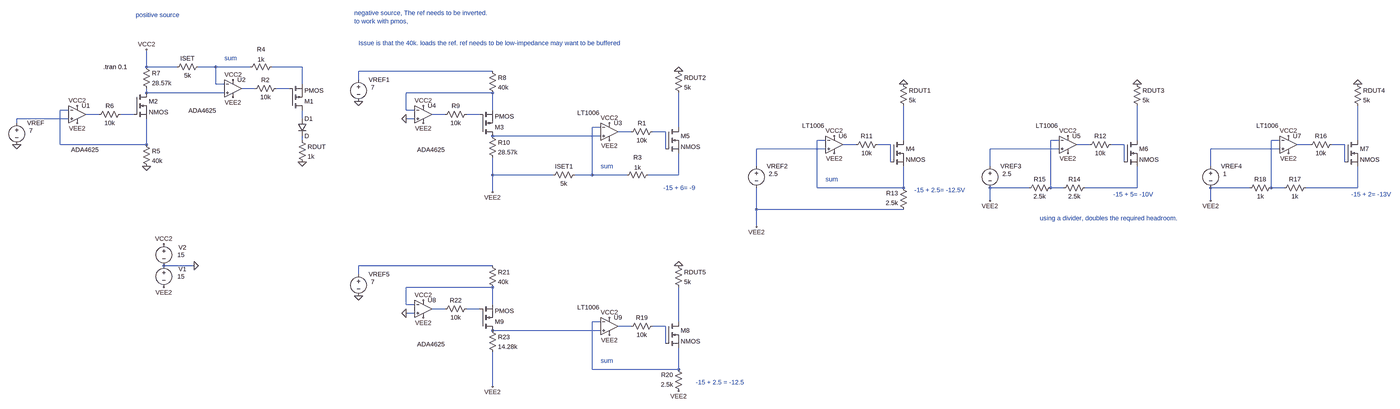
[diagram p0: schematic Draft25.asc, whole sheet]
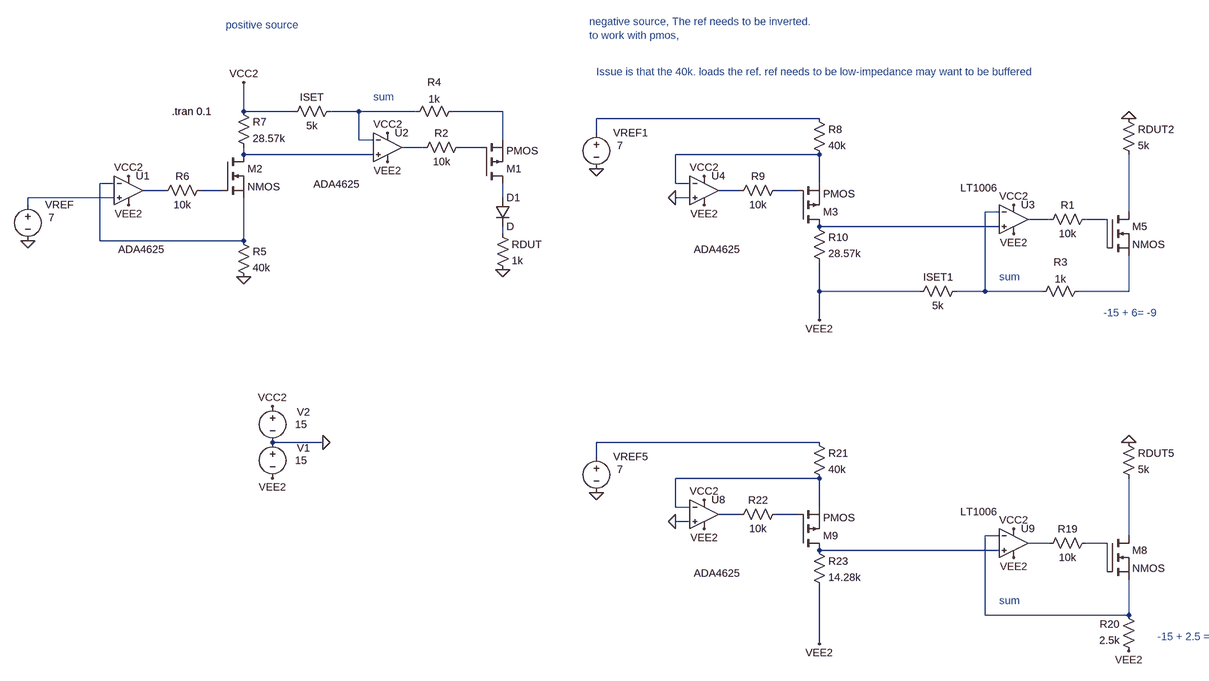
[diagram p1: schematic Draft25.asc, part, row 1 of 1, column 1 of 2]
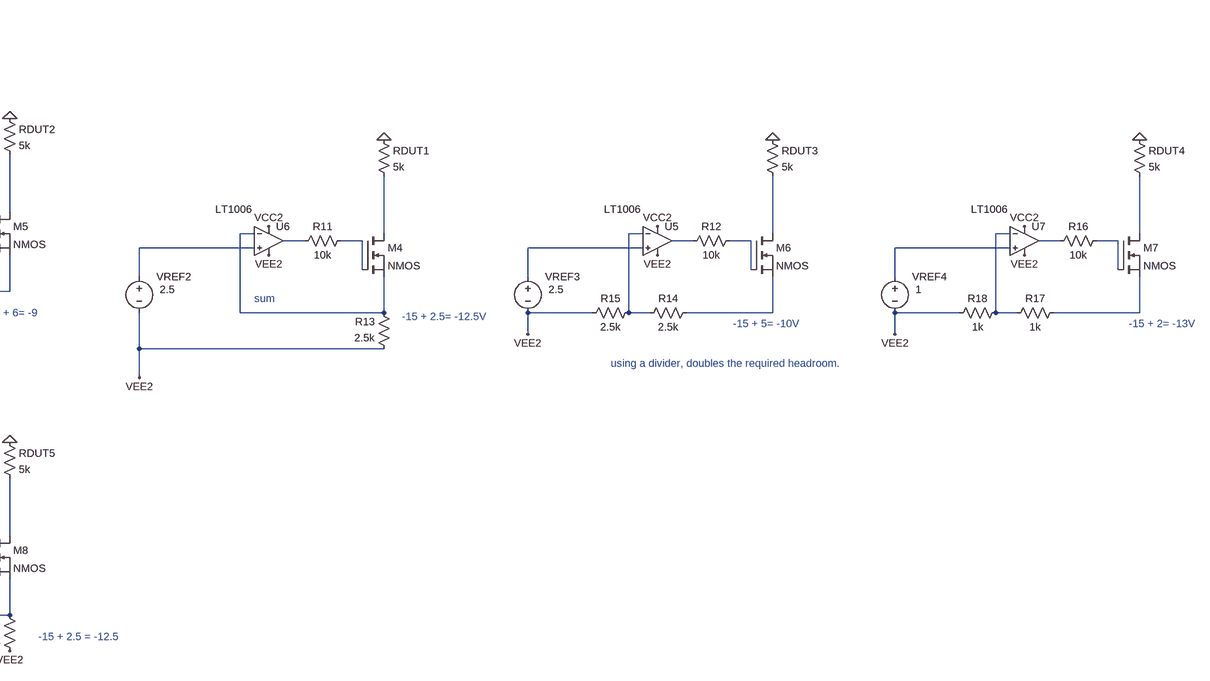
[diagram p2: schematic Draft25.asc, part, row 1 of 1, column 2 of 2]
Draft25.asc, the LTspice schematic file:
Version 4
SHEET 1 4612 1320
WIRE -64 16 -64 -48
WIRE 48 16 -64 16
WIRE 192 16 128 16
WIRE 320 16 192 16
WIRE 512 16 400 16
WIRE 1216 32 720 32
WIRE 720 64 720 32
WIRE 192 80 192 16
WIRE 224 80 192 80
WIRE 512 80 512 16
WIRE 336 96 288 96
WIRE 464 96 416 96
WIRE -64 112 -64 96
WIRE 224 112 -64 112
WIRE 1216 112 896 112
WIRE -64 128 -64 112
WIRE -352 176 -384 176
WIRE 896 176 896 112
WIRE 928 176 896 176
WIRE 1216 176 1216 112
WIRE -240 192 -288 192
WIRE -112 192 -160 192
WIRE 1040 192 992 192
WIRE 1168 192 1120 192
WIRE -352 208 -544 208
WIRE 512 208 512 176
WIRE 928 208 896 208
WIRE -544 224 -544 208
WIRE 1616 240 1584 240
WIRE 1904 240 1904 112
WIRE 1728 256 1680 256
WIRE 1856 256 1808 256
WIRE 1616 272 1216 272
WIRE 512 288 512 272
WIRE 2448 288 2416 288
WIRE 2736 288 2736 160
WIRE 3312 288 3280 288
WIRE 3600 288 3600 160
WIRE 4128 288 4096 288
WIRE 4416 288 4416 160
WIRE -384 304 -384 176
WIRE -64 304 -64 208
WIRE -64 304 -384 304
WIRE 2560 304 2512 304
WIRE 2688 304 2640 304
WIRE 3424 304 3376 304
WIRE 3552 304 3504 304
WIRE 4240 304 4192 304
WIRE 4368 304 4320 304
WIRE 1856 320 1856 256
WIRE 2448 320 2192 320
WIRE 3312 320 3056 320
WIRE 4128 320 3872 320
WIRE 2688 368 2688 304
WIRE 3552 368 3552 304
WIRE 4368 368 4368 304
WIRE 2192 384 2192 320
WIRE 3056 384 3056 320
WIRE 3872 384 3872 320
WIRE 1216 416 1216 352
WIRE 1440 416 1216 416
WIRE 1584 416 1584 240
WIRE 1584 416 1520 416
WIRE 1712 416 1584 416
WIRE 1904 416 1904 336
WIRE 1904 416 1792 416
WIRE 2416 464 2416 288
WIRE 2736 464 2736 384
WIRE 2736 464 2416 464
WIRE 3200 464 3056 464
WIRE 3280 464 3280 288
WIRE 3328 464 3280 464
WIRE 3600 464 3600 384
WIRE 3600 464 3408 464
WIRE 4016 464 3872 464
WIRE 4096 464 4096 288
WIRE 4144 464 4096 464
WIRE 4416 464 4416 384
WIRE 4416 464 4224 464
WIRE 1216 480 1216 416
WIRE 3056 512 3056 464
WIRE 3872 512 3872 464
WIRE 2192 544 2192 464
WIRE 2736 544 2192 544
WIRE 2192 608 2192 544
WIRE 112 752 0 752
WIRE 1216 752 720 752
WIRE 720 784 720 752
WIRE 1216 832 896 832
WIRE 896 896 896 832
WIRE 928 896 896 896
WIRE 1216 896 1216 832
WIRE 1040 912 992 912
WIRE 1168 912 1120 912
WIRE 928 928 896 928
WIRE 1616 960 1584 960
WIRE 1904 960 1904 832
WIRE 1728 976 1680 976
WIRE 1856 976 1808 976
WIRE 1616 992 1216 992
WIRE 1856 1040 1856 976
WIRE 1584 1136 1584 960
WIRE 1904 1136 1904 1056
WIRE 1904 1136 1584 1136
WIRE 1216 1200 1216 1072
FLAG 112 752 0
FLAG 0 832 VEE2
FLAG 0 672 VCC2
FLAG 256 128 VEE2
FLAG 256 64 VCC2
FLAG -320 224 VEE2
FLAG -320 160 VCC2
FLAG -544 304 0
FLAG -64 384 0
FLAG -64 -48 VCC2
FLAG 512 368 0
FLAG 1648 288 VEE2
FLAG 1648 224 VCC2
FLAG 960 224 VEE2
FLAG 960 160 VCC2
FLAG 720 144 0
FLAG 1904 32 0
FLAG 1216 480 VEE2
FLAG 896 208 0
FLAG 2480 336 VEE2
FLAG 2480 272 VCC2
FLAG 2736 80 0
FLAG 2192 608 VEE2
FLAG 3344 336 VEE2
FLAG 3344 272 VCC2
FLAG 3600 80 0
FLAG 3056 512 VEE2
FLAG 4160 336 VEE2
FLAG 4160 272 VCC2
FLAG 4416 80 0
FLAG 3872 512 VEE2
FLAG 1648 1008 VEE2
FLAG 1648 944 VCC2
FLAG 960 944 VEE2
FLAG 960 880 VCC2
FLAG 720 864 0
FLAG 1904 752 0
FLAG 1216 1200 VEE2
FLAG 896 928 0
FLAG 1904 1216 VEE2
SYMBOL voltage 0 736 R0
WINDOW 0 54 29 Left 2
WINDOW 3 50 56 Left 2
WINDOW 123 0 0 Left 0
WINDOW 39 0 0 Left 0
SYMATTR InstName V1
SYMATTR Value 15
SYMBOL res 496 272 R0
SYMATTR InstName RDUT
SYMATTR Value 1k
SYMBOL res 144 0 R90
WINDOW 0 0 56 VBottom 2
WINDOW 3 32 56 VTop 2
SYMATTR InstName ISET
SYMATTR Value 5k
SYMBOL pmos 464 176 M180
SYMATTR InstName M1
SYMBOL voltage 0 656 R0
WINDOW 0 54 29 Left 2
WINDOW 3 50 56 Left 2
WINDOW 123 0 0 Left 0
WINDOW 39 0 0 Left 0
SYMATTR InstName V2
SYMATTR Value 15
SYMBOL res 432 80 R90
WINDOW 0 0 56 VBottom 2
WINDOW 3 32 56 VTop 2
SYMATTR InstName R2
SYMATTR Value 10k
SYMBOL res 416 0 R90
WINDOW 0 -33 56 VBottom 2
WINDOW 3 -27 56 VTop 2
SYMATTR InstName R4
SYMATTR Value 1k
SYMBOL OpAmps\\ADA4625 256 32 R0
WINDOW 3 -165 146 Left 2
SYMATTR InstName U2
SYMBOL diode 496 208 R0
SYMATTR InstName D1
SYMBOL res -80 288 R0
SYMATTR InstName R5
SYMATTR Value 40k
SYMBOL res -144 176 R90
WINDOW 0 0 56 VBottom 2
WINDOW 3 32 56 VTop 2
SYMATTR InstName R6
SYMATTR Value 10k
SYMBOL OpAmps\\ADA4625 -320 128 R0
WINDOW 3 -23 195 Left 2
SYMATTR InstName U1
SYMBOL voltage -544 208 R0
WINDOW 123 0 0 Left 0
WINDOW 39 0 0 Left 0
WINDOW 3 46 44 Left 2
WINDOW 0 38 16 Left 2
SYMATTR Value 7
SYMATTR InstName VREF
SYMBOL res -80 0 R0
SYMATTR InstName R7
SYMATTR Value 28.57k
SYMBOL nmos -112 112 R0
SYMATTR InstName M2
SYMBOL res 1536 400 R90
WINDOW 0 0 56 VBottom 2
WINDOW 3 32 56 VTop 2
SYMATTR InstName ISET1
SYMATTR Value 5k
SYMBOL res 1824 240 R90
WINDOW 0 0 56 VBottom 2
WINDOW 3 32 56 VTop 2
SYMATTR InstName R1
SYMATTR Value 10k
SYMBOL res 1808 400 R90
WINDOW 0 -33 56 VBottom 2
WINDOW 3 -27 56 VTop 2
SYMATTR InstName R3
SYMATTR Value 1k
SYMBOL res 1200 16 R0
SYMATTR InstName R8
SYMATTR Value 40k
SYMBOL res 1136 176 R90
WINDOW 0 0 56 VBottom 2
WINDOW 3 32 56 VTop 2
SYMATTR InstName R9
SYMATTR Value 10k
SYMBOL OpAmps\\ADA4625 960 128 R0
WINDOW 3 -23 195 Left 2
SYMATTR InstName U4
SYMBOL voltage 720 48 R0
WINDOW 123 0 0 Left 0
WINDOW 39 0 0 Left 0
WINDOW 3 46 44 Left 2
WINDOW 0 38 16 Left 2
SYMATTR Value 7
SYMATTR InstName VREF1
SYMBOL res 1200 256 R0
SYMATTR InstName R10
SYMATTR Value 28.57k
SYMBOL OpAmps\\LT1006 1648 192 R0
WINDOW 3 -119 -6 Left 2
SYMATTR InstName U3
SYMBOL res 1888 16 R0
SYMATTR InstName RDUT2
SYMATTR Value 5k
SYMBOL nmos 1856 240 R0
SYMATTR InstName M5
SYMBOL pmos 1168 272 M180
SYMATTR InstName M3
SYMBOL res 2656 288 R90
WINDOW 0 0 56 VBottom 2
WINDOW 3 32 56 VTop 2
SYMATTR InstName R11
SYMATTR Value 10k
SYMBOL res 2752 560 R180
WINDOW 0 36 76 Left 2
WINDOW 3 36 40 Left 2
SYMATTR InstName R13
SYMATTR Value 2.5k
SYMBOL OpAmps\\LT1006 2480 240 R0
WINDOW 3 -119 -6 Left 2
SYMATTR InstName U6
SYMBOL res 2720 64 R0
SYMATTR InstName RDUT1
SYMATTR Value 5k
SYMBOL nmos 2688 288 R0
SYMATTR InstName M4
SYMBOL voltage 2192 368 R0
WINDOW 123 0 0 Left 0
WINDOW 39 0 0 Left 0
WINDOW 3 46 44 Left 2
WINDOW 0 38 16 Left 2
SYMATTR Value 2.5
SYMATTR InstName VREF2
SYMBOL res 3520 288 R90
WINDOW 0 0 56 VBottom 2
WINDOW 3 32 56 VTop 2
SYMATTR InstName R12
SYMATTR Value 10k
SYMBOL res 3312 480 R270
WINDOW 0 32 56 VTop 2
WINDOW 3 0 56 VBottom 2
SYMATTR InstName R14
SYMATTR Value 2.5k
SYMBOL OpAmps\\LT1006 3344 240 R0
WINDOW 3 -119 -6 Left 2
SYMATTR InstName U5
SYMBOL res 3584 64 R0
SYMATTR InstName RDUT3
SYMATTR Value 5k
SYMBOL nmos 3552 288 R0
SYMATTR InstName M6
SYMBOL voltage 3056 368 R0
WINDOW 123 0 0 Left 0
WINDOW 39 0 0 Left 0
WINDOW 3 46 44 Left 2
WINDOW 0 38 16 Left 2
SYMATTR Value 2.5
SYMATTR InstName VREF3
SYMBOL res 3184 480 R270
WINDOW 0 32 56 VTop 2
WINDOW 3 0 56 VBottom 2
SYMATTR InstName R15
SYMATTR Value 2.5k
SYMBOL res 4336 288 R90
WINDOW 0 0 56 VBottom 2
WINDOW 3 32 56 VTop 2
SYMATTR InstName R16
SYMATTR Value 10k
SYMBOL res 4128 480 R270
WINDOW 0 32 56 VTop 2
WINDOW 3 0 56 VBottom 2
SYMATTR InstName R17
SYMATTR Value 1k
SYMBOL OpAmps\\LT1006 4160 240 R0
WINDOW 3 -119 -6 Left 2
SYMATTR InstName U7
SYMBOL res 4400 64 R0
SYMATTR InstName RDUT4
SYMATTR Value 5k
SYMBOL nmos 4368 288 R0
SYMATTR InstName M7
SYMBOL voltage 3872 368 R0
WINDOW 123 0 0 Left 0
WINDOW 39 0 0 Left 0
WINDOW 3 46 44 Left 2
WINDOW 0 38 16 Left 2
SYMATTR Value 1
SYMATTR InstName VREF4
SYMBOL res 4000 480 R270
WINDOW 0 32 56 VTop 2
WINDOW 3 0 56 VBottom 2
SYMATTR InstName R18
SYMATTR Value 1k
SYMBOL res 1824 960 R90
WINDOW 0 0 56 VBottom 2
WINDOW 3 32 56 VTop 2
SYMATTR InstName R19
SYMATTR Value 10k
SYMBOL res 1920 1232 R180
WINDOW 0 36 76 Left 2
WINDOW 3 36 40 Left 2
SYMATTR InstName R20
SYMATTR Value 2.5k
SYMBOL res 1200 736 R0
SYMATTR InstName R21
SYMATTR Value 40k
SYMBOL res 1136 896 R90
WINDOW 0 0 56 VBottom 2
WINDOW 3 32 56 VTop 2
SYMATTR InstName R22
SYMATTR Value 10k
SYMBOL OpAmps\\ADA4625 960 848 R0
WINDOW 3 -23 195 Left 2
SYMATTR InstName U8
SYMBOL voltage 720 768 R0
WINDOW 123 0 0 Left 0
WINDOW 39 0 0 Left 0
WINDOW 3 46 44 Left 2
WINDOW 0 38 16 Left 2
SYMATTR Value 7
SYMATTR InstName VREF5
SYMBOL res 1200 976 R0
SYMATTR InstName R23
SYMATTR Value 14.28k
SYMBOL OpAmps\\LT1006 1648 912 R0
WINDOW 3 -119 -6 Left 2
SYMATTR InstName U9
SYMBOL res 1888 736 R0
SYMATTR InstName RDUT5
SYMATTR Value 5k
SYMBOL nmos 1856 960 R0
SYMATTR InstName M8
SYMBOL pmos 1168 992 M180
SYMATTR InstName M9
TEXT -224 16 Left 2 !.tran 0.1
TEXT 224 -16 Left 2 ;sum
TEXT 1616 384 Left 2 ;sum
TEXT 704 -184 Left 2 ;negative source, The ref needs to be inverted. \nto work with pmos,
TEXT 720 -72 Left 2 ;Issue is that the 40k. loads the ref. ref needs to be low-impedance may want to be buffered
TEXT 2448 432 Left 2 ;sum
TEXT 3240 576 Left 2 ;using a divider, doubles the required headroom.
TEXT 4392 488 Left 2 ;-15 + 2= -13V
TEXT 3512 488 Left 2 ;-15 + 5= -10V
TEXT 2776 472 Left 2 ;-15 + 2.5= -12.5V
TEXT -104 -176 Left 2 ;positive source
TEXT 1848 464 Left 2 ;-15 + 6= -9
TEXT 1616 1104 Left 2 ;sum
TEXT 1968 1184 Left 2 ;-15 + 2.5 = -12.5

The netlist it stands for:
* Draft25.asc
V1 0 VEE2 15
RDUT N020 0 1k
R§ISET N001 VCC2 5k
M1 N014 N005 N002 N002 PMOS
V2 VCC2 0 15
R2 N005 N004 10k
R4 N002 N001 1k
XU2 N006 N001 VCC2 VEE2 N004 ADA4625  ; pins In+ In- V+ V- OUT
D1 N014 N020 D
R5 N008 0 40k
R6 N010 N009 10k
XU1 N013 N008 VCC2 VEE2 N009 ADA4625  ; pins In+ In- V+ V- OUT
VREF N013 0 7
R7 VCC2 N006 28.57k
M2 N006 N010 N008 N008 NMOS
R§ISET1 N015 VEE2 5k
R1 N018 N017 10k
R3 N036 N015 1k
R8 N003 N007 40k
R9 N012 N011 10k
XU4 0 N007 VCC2 VEE2 N011 ADA4625  ; pins In+ In- V+ V- OUT
VREF1 N003 0 7
R10 N019 VEE2 28.57k
XU3 N019 N015 VCC2 VEE2 N017 LT1006  ; pins In+ In- V+ V- OUT
RDUT2 0 N016 5k
M5 N016 N018 N036 N036 NMOS
M3 N019 N012 N007 N007 PMOS
R11 N028 N027 10k
R13 VEE2 N021 2.5k
XU6 N033 N021 VCC2 VEE2 N027 LT1006  ; pins In+ In- V+ V- OUT
RDUT1 0 N022 5k
M4 N022 N028 N021 N021 NMOS
VREF2 N033 VEE2 2.5
R12 N030 N029 10k
R14 N023 N037 2.5k
XU5 N034 N023 VCC2 VEE2 N029 LT1006  ; pins In+ In- V+ V- OUT
RDUT3 0 N024 5k
M6 N024 N030 N037 N037 NMOS
VREF3 N034 VEE2 2.5
R15 VEE2 N023 2.5k
R16 N032 N031 10k
R17 N025 N038 1k
XU7 N035 N025 VCC2 VEE2 N031 LT1006  ; pins In+ In- V+ V- OUT
RDUT4 0 N026 5k
M7 N026 N032 N038 N038 NMOS
VREF4 N035 VEE2 1
R18 VEE2 N025 1k
R19 N046 N045 10k
R20 VEE2 N043 2.5k
R21 N039 N040 40k
R22 N042 N041 10k
XU8 0 N040 VCC2 VEE2 N041 ADA4625  ; pins In+ In- V+ V- OUT
VREF5 N039 0 7
R23 N047 VEE2 14.28k
XU9 N047 N043 VCC2 VEE2 N045 LT1006  ; pins In+ In- V+ V- OUT
RDUT5 0 N044 5k
M8 N044 N046 N043 N043 NMOS
M9 N047 N042 N040 N040 PMOS
.model D D
.lib standard.dio
.model NMOS NMOS
.model PMOS PMOS
.lib standard.mos
.tran 0.1
* sum
* sum
* negative source, The ref needs to be inverted.
* to work with pmos,
* Issue is that the 40k. loads the ref. ref needs to be low-impedance may want to be buffered
* sum
* using a divider, doubles the required headroom.
* -15 + 2= -13V
* -15 + 5= -10V
* -15 + 2.5= -12.5V
* positive source
* -15 + 6= -9
* sum
* -15 + 2.5 = -12.5
.lib LTC.lib
.backanno
.end